# EAGLE design lamloei_node32s3mini_cp2102_main_2layers (EAGLE 7.7.0)
CNAME: LamLoei Node32S3Mini; CREVISION: R1; DESIGNER: lamloei co.,ltd.
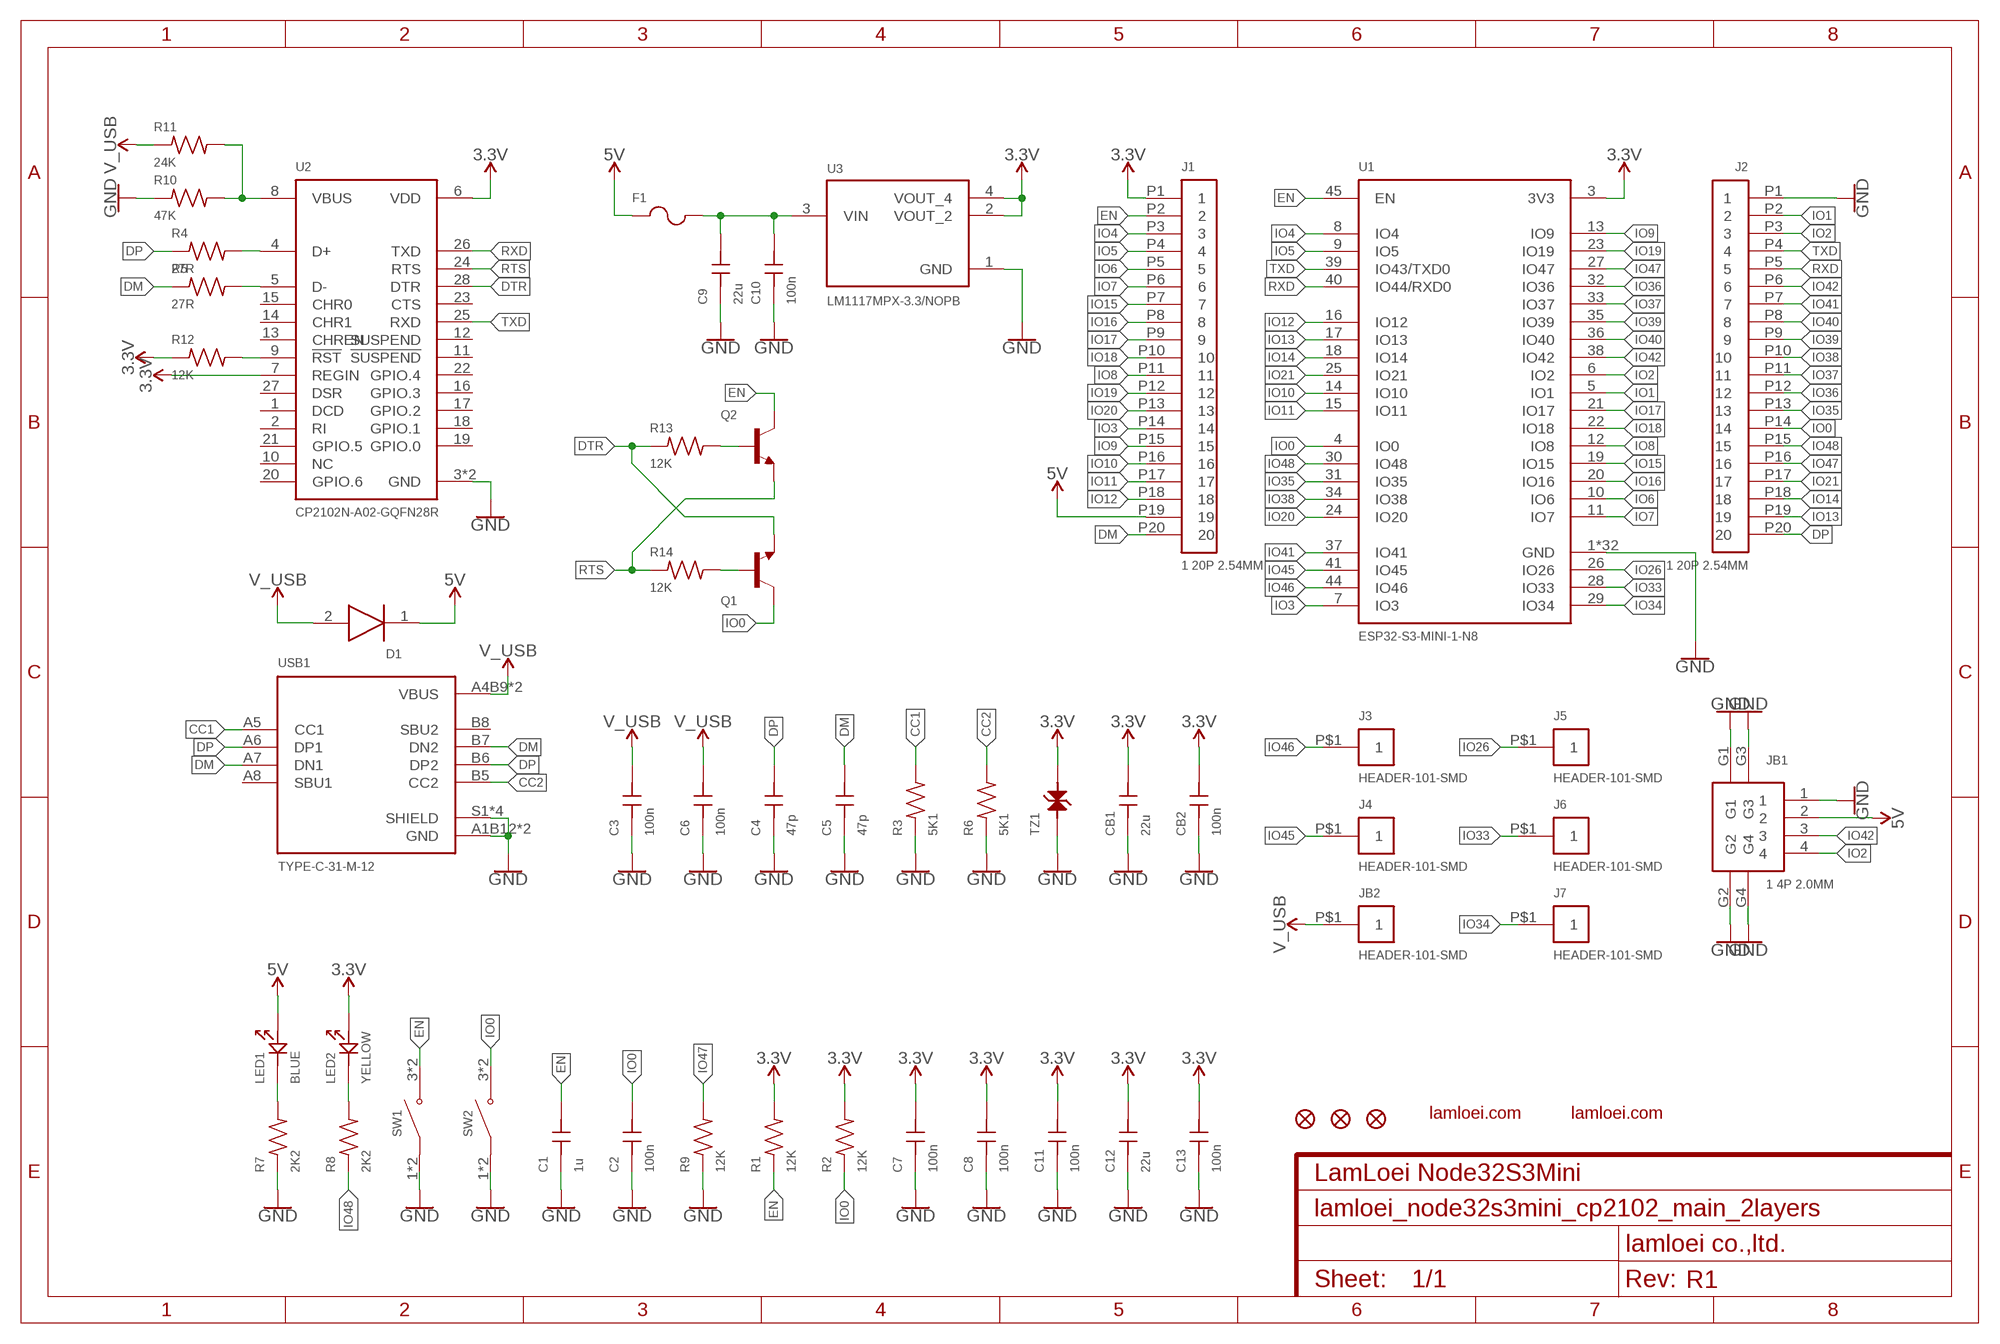
[diagram p0: schematic, sheet 1]

## Parts
C1  1u  GRM155R70J105KA12D  [GRM155R70J105KA12D]
C2  100n  GCM155R71H104KE02D  [GCM155R71H104KE02D]
C3  100n  GCM155R71H104KE02D  [GCM155R71H104KE02D]
C4  47p  GCM1555C1H470JA16D  [GCM1555C1H470JA16D]
C5  47p  GCM1555C1H470JA16D  [GCM1555C1H470JA16D]
C6  100n  GCM155R71H104KE02D  [GCM155R71H104KE02D]
C7  100n  GCM155R71H104KE02D  [GCM155R71H104KE02D]
C8  100n  GCM155R71H104KE02D  [GCM155R71H104KE02D]
C9  22u  GCM21BR71H105KA03L  [GCM21BR71H105KA03L]
C10  100n  GCM155R71H104KE02D  [GCM155R71H104KE02D]
C11  100n  GCM155R71H104KE02D  [GCM155R71H104KE02D]
C12  22u  GCM21BR71H105KA03L  [GCM21BR71H105KA03L]
C13  100n  GCM155R71H104KE02D  [GCM155R71H104KE02D]
CB1  22u  GCM21BR71H105KA03L  [GCM21BR71H105KA03L]
CB2  100n  GCM155R71H104KE02D  [GCM155R71H104KE02D]
D1  PMEG4050EP,115  [PMEG4050EP,115]
F1  MF-NSMF050-2  [MF-NSMF050-2]
J1  1 20P 2.54MM  HEADER-120  [HEADER-120]
J2  1 20P 2.54MM  HEADER-120  [HEADER-120]
J3  HEADER-101-SMD  [HEADER-101-SMD]
J4  HEADER-101-SMD  [HEADER-101-SMD]
J5  HEADER-101-SMD  [HEADER-101-SMD]
J6  HEADER-101-SMD  [HEADER-101-SMD]
J7  HEADER-101-SMD  [HEADER-101-SMD]
JB1  1 4P 2.0MM  A2012WR-S-4P  [A2012WR-S-4P]
JB2  HEADER-101-SMD  [HEADER-101-SMD]
LED1  BLUE  19-217BHC-ZL1M2RY3T  [19-217BHC-ZL1M2RY3T]
LED2  YELLOW  19-213/Y2C-CQ2R2L/3T(CY)  [19-213/Y2C-CQ2R2L/3T(CY)]
Q1  BC847B,215  [BC847B,215]
Q2  BC847B,215  [BC847B,215]
R1  12K  RC0402FR-0712KL  [R0402]
R2  12K  RC0402FR-0712KL  [R0402]
R3  5K1  RC0402FR-075K1L  [R0402]
R4  27R  RC0402FR-0727RL  [R0402]
R5  27R  RC0402FR-0727RL  [R0402]
R6  5K1  RC0402FR-075K1L  [R0402]
R7  2K2  RC0402FR-072K2L  [R0402]
R8  2K2  RC0402FR-072K2L  [R0402]
R9  12K  RC0402FR-0712KL  [R0402]
R10  47K  RC0402FR-0747KL  [R0402]
R11  24K  RC0402FR-0724KL  [R0402]
R12  12K  RC0402FR-0712KL  [R0402]
R13  12K  RC0402FR-0712KL  [R0402]
R14  12K  RC0402FR-0712KL  [R0402]
SW1  K2-1808SN-A4SW-01  [K2-1808SN-A4SW-01]
SW2  K2-1808SN-A4SW-01  [K2-1808SN-A4SW-01]
TZ1  LXES15AAA1-153  [LXES15AAA1-153]
U1  ESP32-S3-MINI-1-N8  [ESP32-S3-MINI-1-N8]
U2  CP2102N-A02-GQFN28R  [CP2102N-A02-GQFN28R]
U3  LM1117MPX-3.3/NOPB  [LM1117MPX-3.3/NOPB]
USB1  TYPE-C-31-M-12  [TYPE-C-31-M-12]
ZFD1  FIDUCIAL1X2  [FIDUCIAL-1X2]
ZFD2  FIDUCIAL1X2  [FIDUCIAL-1X2]
ZFD3  FIDUCIAL1X2  [FIDUCIAL-1X2]
ZL1  LAMLEOI_LOGO_3  [LAMLEOI_LOGO_3]
ZL2  LAMLEOI_LOGO_3  [LAMLEOI_LOGO_3]

## Nets
3.3V: C7.2 C8.2 C11.2 C12.2 C13.2 CB1.2 CB2.2 J1.P1 LED2.2 R1.2 R2.2 R12.1 TZ1.2 U1.3(3V3) U2.6(VDD) U2.7(REGIN) U3.2(VOUT_2) U3.4(VOUT_4)
5V: D1.1(K) F1.1 J1.P19 JB1.2 LED1.2
CC1: R3.2 USB1.A5(CC1)
CC2: R6.2 USB1.B5(CC2)
DM: C5.2 J1.P20 R5.1 USB1.A7(DN1) USB1.B7(DN2)
DP: C4.2 J2.P20 R4.1 USB1.A6(DP1) USB1.B6(DP2)
DTR: Q1.E R13.1 U2.28(DTR)
EN: C1.2 J1.P2 Q2.C R1.1 SW1.3(NO) SW1.4(NO) U1.45(EN)
GND: C1.1 C2.1 C3.1 C4.1 C5.1 C6.1 C7.1 C8.1 C9.1 C10.1 C11.1 C12.1 C13.1 CB1.1 CB2.1 J2.P1 JB1.1 JB1.G1 JB1.G2 JB1.G3 JB1.G4 R3.1 R6.1 R7.1 R9.1 R10.1 SW1.1(COM) SW1.2(COM) SW2.1(COM) SW2.2(COM) TZ1.1 U1.1(GND) U1.2(GND) U1.42(GND) U1.43(GND) U1.46(GND) U1.47(GND) U1.48(GND) U1.49(GND) U1.50(GND) U1.51(GND) U1.52(GND) U1.53(GND) U1.54(GND) U1.55(GND) U1.56(GND) U1.57(GND) U1.58(GND) U1.59(GND) U1.60(GND) U1.61(GND) U1.61_1(GND) U1.61_2(GND) U1.61_3(GND) U1.61_4(GND) U1.61_5(GND) U1.61_6(GND) U1.61_7(GND) U1.61_8(GND) U1.62(GND) U1.63(GND) U1.64(GND) U1.65(GND) U2.3(GND) U2.29(GND) U3.1(GND) USB1.A1B12(GND) USB1.B1A12(GND) USB1.S1(SHIELD) USB1.S2(SHIELD) USB1.S3(SHIELD) USB1.S4(SHIELD)
IO0: C2.2 J2.P14 Q1.C R2.1 SW2.3(NO) SW2.4(NO) U1.4(IO0)
IO1: J2.P2 U1.5(IO1)
IO2: J2.P3 JB1.4 U1.6(IO2)
IO3: J1.P14 U1.7(IO3)
IO4: J1.P3 U1.8(IO4)
IO5: J1.P4 U1.9(IO5)
IO6: J1.P5 U1.10(IO6)
IO7: J1.P6 U1.11(IO7)
IO8: J1.P11 U1.12(IO8)
IO9: J1.P15 U1.13(IO9)
IO10: J1.P16 U1.14(IO10)
IO11: J1.P17 U1.15(IO11)
IO12: J1.P18 U1.16(IO12)
IO13: J2.P19 U1.17(IO13)
IO14: J2.P18 U1.18(IO14)
IO15: J1.P7 U1.19(IO15)
IO16: J1.P8 U1.20(IO16)
IO17: J1.P9 U1.21(IO17)
IO18: J1.P10 U1.22(IO18)
IO19: J1.P12 U1.23(IO19)
IO20: J1.P13 U1.24(IO20)
IO21: J2.P17 U1.25(IO21)
IO26: J5.P$1 U1.26(IO26)
IO33: J6.P$1 U1.28(IO33)
IO34: J7.P$1 U1.29(IO34)
IO35: J2.P13 U1.31(IO35)
IO36: J2.P12 U1.32(IO36)
IO37: J2.P11 U1.33(IO37)
IO38: J2.P10 U1.34(IO38)
IO39: J2.P9 U1.35(IO39)
IO40: J2.P8 U1.36(IO40)
IO41: J2.P7 U1.37(IO41)
IO42: J2.P6 JB1.3 U1.38(IO42)
IO45: J4.P$1 U1.41(IO45)
IO46: J3.P$1 U1.44(IO46)
IO47: J2.P16 R9.2 U1.27(IO47)
IO48: J2.P15 R8.1 U1.30(IO48)
N$1: R5.2 U2.5(D-)
N$2: R4.2 U2.4(D+)
N$3: C9.2 C10.2 F1.2 U3.3(VIN)
N$4: LED1.1 R7.2
N$5: LED2.1 R8.2
N$6: Q2.B R13.2
N$7: Q1.B R14.2
N$8: R12.2 U2.9(!RST)
N$10: R10.2 R11.2 U2.8(VBUS)
RTS: Q2.E R14.1 U2.24(RTS)
RXD: J2.P5 U1.40(IO44/RXD0) U2.26(TXD)
TXD: J2.P4 U1.39(IO43/TXD0) U2.25(RXD)
V_USB: C3.2 C6.2 D1.2(A) JB2.P$1 R11.1 USB1.A4B9(VBUS) USB1.B4A9(VBUS)
Unconnected: U2.1(DCD) U2.2(RI) U2.10(NC) U2.11(!SUSPEND) U2.12(SUSPEND) U2.13(CHREN) U2.14(CHR1) U2.15(CHR0) U2.16(GPIO.3) U2.17(GPIO.2) U2.18(GPIO.1) U2.19(GPIO.0) U2.20(GPIO.6) U2.22(GPIO.4) U2.23(CTS) U2.27(DSR) USB1.A8(SBU1) USB1.B8(SBU2)

## Power pins joined to a net without a drawn wire
GPIO.5: U2.21(GPIO.5)

## Library data of the parts
C1 = lamloei_e77_GRM155R70J105KA12D:GRM155R70J105KA12D; MANUFACTURER_PART_NUMBER: GRM155R70J105KA12D; VENDOR: Murata
C2 C3 C6-C8 C10 C11 C13 CB2 = lamloei_e77_GCM155R71H104KE02D:GCM155R71H104KE02D; MANUFACTURER_PART_NUMBER: GCM155R71H104KE02D; VENDOR: Murata
C4 C5 = lamloei_e77_GCM1555C1H470JA16D:GCM1555C1H470JA16D; MANUFACTURER_PART_NUMBER: GCM1555C1H470JA16D; VENDOR: Murata
C9 C12 CB1 = lamloei_e77_GCM21BR71H105KA03L:GCM21BR71H105KA03L; MANUFACTURER_PART_NUMBER: GCM21BR71H105KA03L; VENDOR: Murata
D1 = lamloei_e77_PMEG4050EP_115:PMEG4050EP,115: Nexperia PMEG4050EP,115 SMT Schottky Diode, 40V 5A, 2-Pin SOD-128 Source: Datasheet <http://uk.rs-online.com/web/p/products/7805405P>; DESCRIPTION: Nexperia PMEG4050EP,115 SMT Schottky Diode, 40V 5A, 2-Pin SOD-128; HEIGHT: 1.1mm; MANUFACTURER_NAME: Nexperia; MANUFACTURER_PART_NUMBER: PMEG4050EP,115; RS_PART_NUMBER: 7805405P; RS_PRICE-STOCK: http://uk.rs-online.com/web/p/products/7805405P
F1 = lamloei_e77_mf-nsmf050-2-noretrict:MF-NSMF050-2; DATASHEET: https://datasheet.lcsc.com/lcsc/1809212037_BOURNS-MF-NSMF050-2_C75464.pdf; DESCRIPTIONS: 13.2V 1A 1206 PTC Resettable Fuses; LCSC_PART: C75464; MANUFACTURER: BOURNS; MANUFACTURER_PART_NUMBER: MF-NSMF050-2; OPERATION_TEMPERATURE: -40°C ~ +85°C; OPERATION_TEMPERATURE_HIGH: +85°C; OPERATION_TEMPERATURE_LOW: -40°C; PACKAGE: 1206; PCBA_COST: Extended
J1 = lamloei_e77_HEADER-120A:HEADER-120
J2 = lamloei_e77_HEADER-120B:HEADER-120
J3-J7 JB2 = lamloei_e77_HEADER-101-SMD:HEADER-101-SMD
JB1 = lamloei_e77_a2012wr-s-4p:A2012WR-S-4P
LED1 = lamloei_e77_19-217BHC-ZL1M2RY3T:19-217BHC-ZL1M2RY3T; MANUFACTURER_PART_NUMBER: 19-217BHC-ZL1M2RY3T; VENDOR: Everlight Elec
LED2 = lamloei_e77_19-213Y2C-CQ2R2L3T(CY):19-213/Y2C-CQ2R2L/3T(CY); MANUFACTURER_PART_NUMBER: 19-213/Y2C-CQ2R2L/3T(CY); VENDOR: Everlight Elec
Q1 Q2 = lamloei_e77_bc847b_215:BC847B,215; AVAILABILITY: In Stock; DESCRIPTION: Bipolar (BJT) Transistor NPN 45V 100mA 100MHz 300mW Surface Mount SOT-23-3 (TO-236); MF: ON Semiconductor; MP: BC847BLT3G; PACKAGE: SOT-23-3 ON Semiconductor; PRICE: None
R1 R2 R9 R12-R14 = lamloei_e77_rc0402fr-0712kl:RC0402FR-0712KL; DATASHEET: https://datasheet.lcsc.com/lcsc/1811081726_YAGEO-RC0402FR-0712KL_C114760.pdf; DESCRIPTIONS: 12kΩ ±1% 0.0625W ±100ppm/°C; DIELECTRIC: X7R; LCSC_PART: C114760; MANUFACTURER: YAGEO; MANUFACTURER_PART_NUMBER: RC0402FR-0712KL; OPERATION_POWER: 1/16W; OPERATION_TEMPERATURE: -55°C ~ +155°C; OPERATION_TEMPERATURE_HIGH: +155°C; OPERATION_TEMPERATURE_LOW: -55°C; PACKAGE: 0402; PCBA_COST: EXTENDED; RATED_VOLTAGE: 100VDC; RESISTANCE: 12kΩ; TOLERANCE: ±1%
R3 R6 = lamloei_e77_rc0402fr-075k1l:RC0402FR-075K1L; DATASHEET: https://datasheet.lcsc.com/lcsc/1809201112_YAGEO-RC0402FR-075K1L_C105872.pdf; DESCRIPTIONS: 5.1kΩ ±1% 0.0625W ±100ppm/°C; DIELECTRIC: X7R; LCSC_PART: C105872; MANUFACTURER: YAGEO; MANUFACTURER_PART_NUMBER: RC0402FR-075K1L; OPERATION_POWER: 1/16W; OPERATION_TEMPERATURE: -55°C ~ +155°C; OPERATION_TEMPERATURE_HIGH: +155°C; OPERATION_TEMPERATURE_LOW: -55°C; PACKAGE: 0402; PCBA_COST: EXTENDED; RATED_VOLTAGE: 100VDC; RESISTANCE: 5.1kΩ; TOLERANCE: ±1%
R4 R5 = lamloei_e77_rc0402fr-0727rl:RC0402FR-0727RL; DATASHEET: https://datasheet.lcsc.com/lcsc/1810241334_YAGEO-RC0402FR-0727RL_C138021.pdf; DESCRIPTIONS: 27Ω ±1% 0.0625W ±100ppm/°C; DIELECTRIC: X7R; LCSC_PART: C138021; MANUFACTURER: YAGEO; MANUFACTURER_PART_NUMBER: RC0402FR-0727RL; OPERATION_POWER: 1/16W; OPERATION_TEMPERATURE: -55°C ~ +155°C; OPERATION_TEMPERATURE_HIGH: +155°C; OPERATION_TEMPERATURE_LOW: -55°C; PACKAGE: 0402; PCBA_COST: EXTENDED; RATED_VOLTAGE: 100VDC; RESISTANCE: 27Ω; TOLERANCE: ±1%
R7 R8 = lamloei_e77_rc0402fr-072k2l:RC0402FR-072K2L; DATASHEET: https://datasheet.lcsc.com/lcsc/1809201112_YAGEO-RC0402FR-072K2L_C114762.pdf; DESCRIPTIONS: 2.2kΩ ±1% 0.0625W ±100ppm/°C; DIELECTRIC: X7R; LCSC_PART: C114762; MANUFACTURER: YAGEO; MANUFACTURER_PART_NUMBER: RC0402FR-072K2L; OPERATION_POWER: 1/16W; OPERATION_TEMPERATURE: -55°C ~ +155°C; OPERATION_TEMPERATURE_HIGH: +155°C; OPERATION_TEMPERATURE_LOW: -55°C; PACKAGE: 0402; PCBA_COST: EXTENDED; RATED_VOLTAGE: 100VDC; RESISTANCE: 2.2kΩ; TOLERANCE: ±1%
R10 = lamloei_e77_rc0402fr-0747kl:RC0402FR-0747KL; DATASHEET: https://datasheet.lcsc.com/lcsc/1811011510_YAGEO-RC0402FR-0747KL_C93943.pdf; DESCRIPTIONS: 47kΩ ±1% 0.0625W ±100ppm/°C; DIELECTRIC: X7R; LCSC_PART: C93943; MANUFACTURER: YAGEO; MANUFACTURER_PART_NUMBER: RC0402FR-0747KL; OPERATION_POWER: 1/16W; OPERATION_TEMPERATURE: -55°C ~ +155°C; OPERATION_TEMPERATURE_HIGH: +155°C; OPERATION_TEMPERATURE_LOW: -55°C; PACKAGE: 0402; PCBA_COST: EXTENDED; RATED_VOLTAGE: 100VDC; RESISTANCE: 47kΩ; TOLERANCE: ±1%
R11 = lamloei_e77_rc0402fr-0724kl:RC0402FR-0724KL; DATASHEET: https://datasheet.lcsc.com/lcsc/1810241334_YAGEO-RC0402FR-0724KL_C138026.pdf; DESCRIPTIONS: 24kΩ ±1% 0.0625W ±100ppm/°C; DIELECTRIC: X7R; LCSC_PART: C138026; MANUFACTURER: YAGEO; MANUFACTURER_PART_NUMBER: RC0402FR-0724KL; OPERATION_POWER: 1/16W; OPERATION_TEMPERATURE: -55°C ~ +155°C; OPERATION_TEMPERATURE_HIGH: +155°C; OPERATION_TEMPERATURE_LOW: -55°C; PACKAGE: 0402; PCBA_COST: EXTENDED; RATED_VOLTAGE: 100VDC; RESISTANCE: 24kΩ; TOLERANCE: ±1%
SW1 SW2 = lamloei_e77_K2-1808SN-A4SW-01:K2-1808SN-A4SW-01: Check prices <https://pricing.snapeda.com/parts/4-1437565-2/TE%20Connectivity/view-part?ref=eda>; AVAILABILITY: In Stock; COMMENT: 4-1437565-2; CONFIGURATION_POLE-THROW: Single Pole - Single Throw; CONTACT_CURRENT_RATING: 50 mA; DESCRIPTION: Tactile Switch SPST-NO Top Actuated Surface Mount; EU_ROHS_COMPLIANCE: Compliant; MF: TE Connectivity; MP: 4-1437565-2; PACKAGE: None; PRICE: None
TZ1 = lamloei_e77_lxes15aaa1-153:LXES15AAA1-153; DATASHEET: https://datasheet.lcsc.com/lcsc/1811081617_Murata-Electronics-LXES15AAA1-153_C86141.pdf; DESCRIPTIONS: Bidirectional 4V 0402 Diodes - ESD; LCSC_PART: C86141; MANUFACTURER: Murata; MANUFACTURER_PART_NUMBER: LXES15AAA1-153; OPERATION_TEMPERATURE: -40°C ~ +85°C; OPERATION_TEMPERATURE_HIGH: +85°C; OPERATION_TEMPERATURE_LOW: -40°C; PACKAGE: 0402; PCBA_COST: EXTENDED; RATED_VOLTAGE: 4V
U1 = lamloei_e77_ESP32-S3-MINI-ANT:ESP32-S3-MINI-1-N8
U2 = lamloei_e77_cp2102n-a02-gqfn24r:CP2102N-A02-GQFN28R
U3 = lamloei_e77_LM1117MPX-3.3_NOPB:LM1117MPX-3.3/NOPB: 800-mA 15-V linear voltage regulator 4-SOT-223 0 to 125 Check prices <https://pricing.snapeda.com/parts/LM1117MPX-3.3/NOPB/Texas%20Instruments/view-part?ref=eda>; AVAILABILITY: In Stock; DESCRIPTION: 800-mA 15-V linear voltage regulator 4-SOT-223 0 to 125; MF: Texas Instruments; MP: LM1117MPX-3.3/NOPB; PACKAGE: SOT-223-4 Texas Instruments; PRICE: None; PURCHASE-URL: https://pricing.snapeda.com/search/part/LM1117MPX-3.3/NOPB/?ref=eda
USB1 = _lamloei_e77_TYPE-C-31-M-12:TYPE-C-31-M-12; AVAILABILITY: Unavailable; DESCRIPTION: USB Connectors 24 Receptacle 1 8.94*7.3mm RoHS; DIFFX: 1.75; DIFFY: -3.53; MF: HRO Electronics Co., Ltd.; MP: TYPE-C-31-M-12; PACKAGE: Package; PRICE: None
ZFD1-ZFD3 = SparkFun-Aesthetics:FIDUCIAL: Fiducial Alignment Points Point-of-reference for pick-and-place machines and other optical instruments.
ZL1 ZL2 = lamloei_logo_3:LAMLEOI_LOGO_3: lamloei

## Board
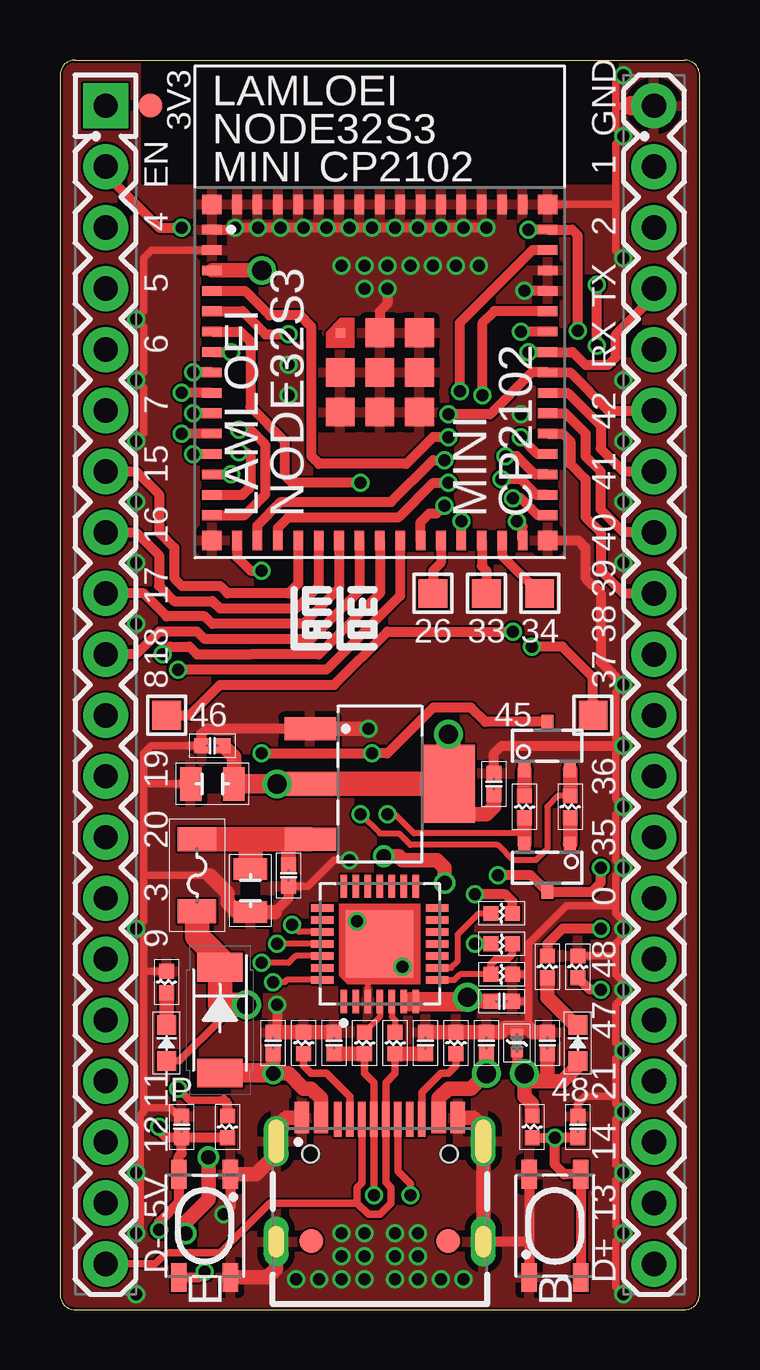
[diagram p1: board, top side]
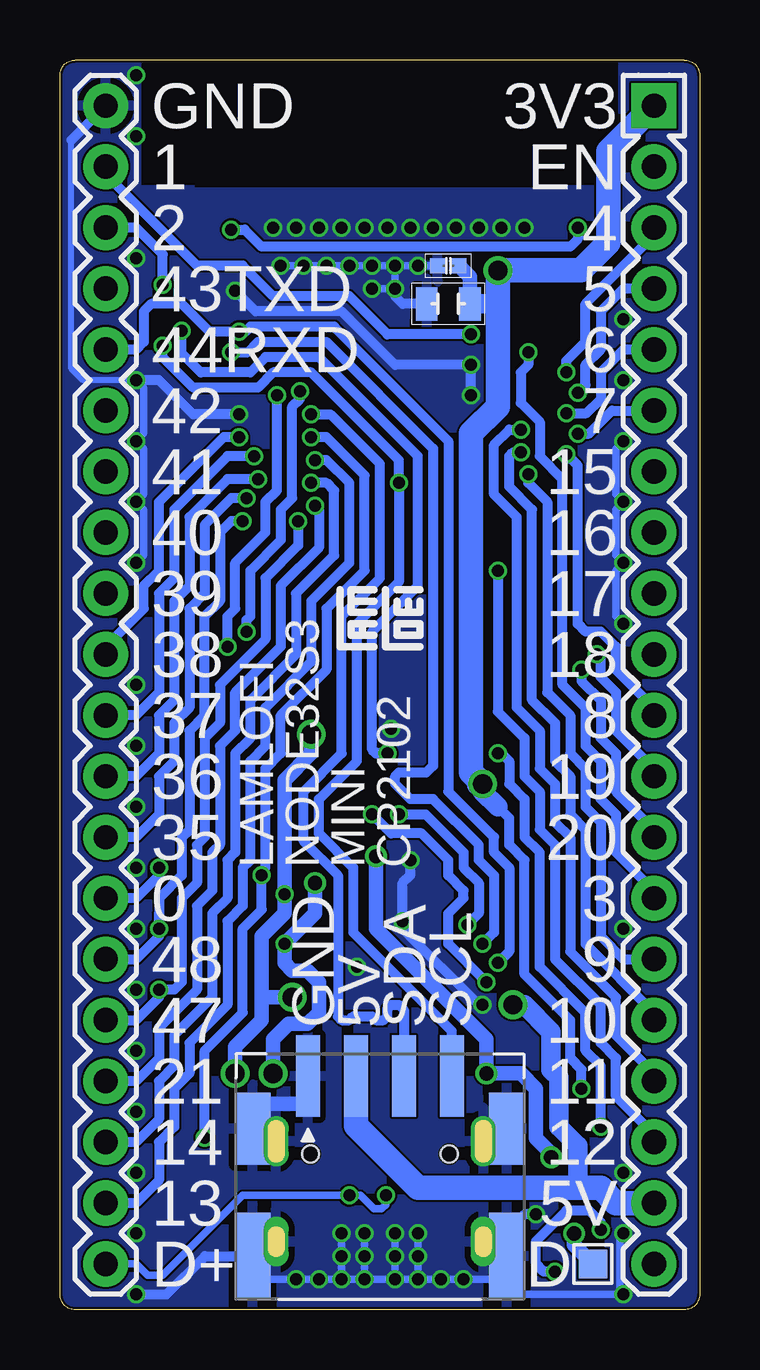
[diagram p2: board, bottom side, seen from below]

Size 26.67 x 52.07 mm. Coordinates in mm from the lower left corner, seen from the top.
Outline: 26.04,0 arc90 26.67,0.64 26.67,51.44 arc90 26.04,52.07 0.64,52.07 arc90 0,51.44 0,0.64 arc90 0.64,0 26.04,0
Copper layers (1*16): Top 0.035mm / dielectric 0.2mm / Bottom 0.035mm
Design rules "jlcpcb-2-layer": minimum track width 3.5mil, minimum drill 0.2mm, track to track 3.5mil, track to pad 5mil, pad to pad 5mil, via to via 5mil, smd to smd 0mil, copper to edge 0.1mm, drill to drill 5mil, minimum pad ring 4mil, minimum via ring 4mil, stop-mask expansion 3mil, vias tented up to drill 100mil, thermal gap 10mil

### Footprints (pad centres in the part's own frame; a part is rotated, then mirrored left to right if it is on the bottom)
GRM155R70J105KA12D = smd 0.62 x 0.62: 1 -0.45,0; 2 0.45,0
GCM155R71H104KE02D = smd 0.62 x 0.62: 1 -0.45,0; 2 0.45,0
GCM1555C1H470JA16D = smd 0.62 x 0.62: 1 -0.45,0; 2 0.45,0
GCM21BR71H105KA03L = smd 0.9 x 1.4: 1 -0.9,0; 2 0.9,0
PMEG4050EP,115 = smd 1.2 x 1.9: 1 -2.2,0; 2 2.2,0
MF-NSMF050-2 = smd 1 x 1.6: 1 -1.5,0; 2 1.5,0
HEADER-120 = drill 1.016 pad 1.88 square: P1 24.13,0 | drill 1.016 pad 1.88: P2 21.59,0; P3 19.05,0; P4 16.51,0; P5 13.97,0; P6 11.43,0; P7 8.89,0; P8 6.35,0; P9 3.81,0; P10 1.27,0; P11 -1.27,0; P12 -3.81,0; P13 -6.35,0; P14 -8.89,0; P15 -11.43,0; P16 -13.97,0; P17 -16.51,0; P18 -19.05,0; P19 -21.59,0; P20 -24.13,0
HEADER-120' = drill 1.016 pad 1.88: P1 24.13,0; P2 21.59,0; P3 19.05,0; P4 16.51,0; P5 13.97,0; P6 11.43,0; P7 8.89,0; P8 6.35,0; P9 3.81,0; P10 1.27,0; P11 -1.27,0; P12 -3.81,0; P13 -6.35,0; P14 -8.89,0; P15 -11.43,0; P16 -13.97,0; P17 -16.51,0; P18 -19.05,0; P19 -21.59,0; P20 -24.13,0
HEADER-101-SMD = smd 1.2 x 1.2: P$1 0,0
A2012WR-S-4P = smd 1 x 3.4: 1 -3,3.7; 2 -1,3.7; 3 1,3.7; 4 3,3.7 | smd 1.5 x 3.6: G1 -5.3,-3.8; G2 5.3,-3.8 | smd 1.5 x 3: G3 -5.3,1.5; G4 5.3,1.5
19-217BHC-ZL1M2RY3T = smd 0.8 x 0.8: 1 -0.75,0; 2 0.75,0
19-213/Y2C-CQ2R2L/3T(CY) = smd 0.8 x 0.8: 1 -0.75,0; 2 0.75,0
BC847B,215 = smd 0.6 x 0.5: B 1,-0.95; C -1,0; E 1,0.95
R0402 = smd 0.62 x 0.62: 1 -0.45,0; 2 0.45,0
K2-1808SN-A4SW-01 = smd 1.2 x 0.65: 1 -2.15,1.075; 2 2.15,1.075; 3 -2.15,-1.075; 4 2.15,-1.075
LXES15AAA1-153 = smd 0.4 x 0.5: 1 -0.4,0; 2 0.4,0
ESP32-S3-MINI-1-N8 = smd 0.8 x 0.4: 1 -7,5.95; 2 -7,5.1; 3 -7,4.25; 4 -7,3.4; 5 -7,2.55; 6 -7,1.7; 7 -7,0.85; 8 -7,0; 9 -7,-0.85; 10 -7,-1.7; 11 -7,-2.55; 12 -7,-3.4; 13 -7,-4.25; 14 -7,-5.1; 15 -7,-5.95; 31 7,-5.95; 32 7,-5.1; 33 7,-4.25; 34 7,-3.4; 35 7,-2.55; 36 7,-1.7; 37 7,-0.85; 38 7,0; 39 7,0.85; 40 7,1.7; 41 7,2.55; 42 7,3.4; 43 7,4.25; 44 7,5.1; 45 7,5.95 | smd 0.4 x 0.8: 16 -5.95,-7; 17 -5.1,-7; 18 -4.25,-7; 19 -3.4,-7; 20 -2.55,-7; 21 -1.7,-7; 22 -0.85,-7; 23 0,-7; 24 0.85,-7; 25 1.7,-7; 26 2.55,-7; 27 3.4,-7; 28 4.25,-7; 29 5.1,-7; 30 5.95,-7; 46 5.95,7; 47 5.1,7; 48 4.25,7; 49 3.4,7; 50 2.55,7; 51 1.7,7; 52 0.85,7; 53 0,7; 54 -0.85,7; 55 -1.7,7; 56 -2.55,7; 57 -3.4,7; 58 -4.25,7; 59 -5.1,7; 60 -5.95,7 | smd 1.2 x 1.2: 61 0,0; 61_2 0,1.65; 61_3 1.65,1.65; 61_4 1.65,0; 61_5 1.65,-1.65; 61_6 0,-1.65; 61_7 -1.65,-1.65; 61_8 -1.65,0 | smd 0.4 x 0.4: 61_1 -1.65,1.65 | smd 0.8 x 0.8: 62 -7,7; 63 -7,-7; 64 7,-7; 65 7,7
CP2102N-A02-GQFN28R = smd 0.95 x 0.29: 1 -2.4,1.5; 2 -2.4,1; 3 -2.4,0.5; 4 -2.4,0; 5 -2.4,-0.5; 6 -2.4,-1; 7 -2.4,-1.5; 15 2.4,-1.5; 16 2.4,-1; 17 2.4,-0.5; 18 2.4,0; 19 2.4,0.5; 20 2.4,1; 21 2.4,1.5 | smd 0.29 x 0.95: 8 -1.5,-2.4; 9 -1,-2.4; 10 -0.5,-2.4; 11 0,-2.4; 12 0.5,-2.4; 13 1,-2.4; 14 1.5,-2.4; 22 1.5,2.4; 23 1,2.4; 24 0.5,2.4; 25 0,2.4; 26 -0.5,2.4; 27 -1,2.4; 28 -1.5,2.4 | smd 2.8 x 2.8: 29 0,0
LM1117MPX-3.3/NOPB = smd 2.15 x 0.95: 1 2.9,-2.3; 2 2.9,0; 3 2.9,2.3 | smd 2.15 x 3.25: 4 -2.9,0
TYPE-C-31-M-12 = smd 0.6 x 1.3: A1B12 3.25,-3.56; A4B9 2.45,-3.56; B1A12 -3.25,-3.56; B4A9 -2.45,-3.56 | smd 0.3 x 1.45: A5 1.25,-3.485; A6 0.25,-3.485; A7 -0.25,-3.485; A8 -1.25,-3.485; B5 -1.75,-3.485; B6 -0.75,-3.485; B7 0.75,-3.485; B8 1.75,-3.485 | drill 0.65 pad 1.05 long: S1 4.32,-2.57; S2 -4.32,-2.57; S3 4.32,1.61; S4 -4.32,1.61 | hole 0.7: 2.89,-2.04; -2.89,-2.04
FIDUCIAL-1X2 = smd 1 x 1: 1 0,0

### Placement (x,y rotation side)
C1  5.08,7.62 270 top
C2  21.59,7.62 270 top
C3  8.89,11.11 270 top
C4  11.43,11.11 270 top
C5  15.24,11.11 270 top
C6  17.78,11.11 270 top
C7  20.32,11.11 270 top
C8  18.41,12.86 180 top
C9  7.94,17.46 90 top
C10  9.53,18.1 90 top
C11  18.1,21.91 270 top
C12  6.35,21.91 0 top
C13  6.35,23.5 0 top
CB1  10.48,41.91 0 bottom
CB2  10.48,43.5 0 bottom
D1  6.67,12.06 270 top
F1  5.71,18.1 90 top
J1  1.91,26.04 90 top
J2  1 20P 2.54MM  [HEADER-120']  24.77,26.04 90 top
J3  4.45,24.77 0 top
J4  22.23,24.77 0 top
J5  15.56,29.84 0 top
J6  17.78,29.84 0 top
J7  20,29.84 0 top
JB1  13.34,6.03 0 bottom
JB2  4.45,1.91 0 bottom
LED1  4.45,11.11 270 top
LED2  21.59,11.11 270 top
Q1  20.32,18.41 90 top
Q2  20.32,23.5 270 top
R1  6.99,7.62 90 top
R2  19.68,7.62 90 top
R3  10.16,11.11 270 top
R4  12.7,11.11 90 top
R5  13.97,11.11 90 top
R6  16.51,11.11 270 top
R7  4.45,13.65 270 top
R8  20.32,14.29 270 top
R9  21.59,14.29 270 top
R10  18.41,13.97 180 top
R11  18.41,15.24 0 top
R12  18.41,16.51 180 top
R13  19.37,20.95 90 top
R14  21.27,20.95 270 top
SW1  6.03,3.49 270 top
SW2  20.64,3.49 90 top
TZ1  19.05,11.11 270 top
U1  13.34,39.05 0 top
U2  13.34,15.24 90 top
U3  13.34,21.91 180 top
USB1  13.34,4.45 180 top
ZFD1  3.77,50.16 0 top
ZFD2  10.48,2.86 0 top
ZFD3  16.19,2.86 0 top
ZL1  9.45,27.3 0 top
ZL2  15.32,27.3 0 bottom

### Tracks (layer width: path | path; a pad name or v marks a point on that pad's centre or on a via)
3.3V  (via drill 0.5, 0.8)
  Top 0.254: 12.34,21.91 12.38,21.91 | U2.6 U2.7
  Top 0.305: 6.83,8.73 5.4,8.73 v4.92,9.21
  Top 0.406: TZ1.2 19.05,10.16 v19.37,9.84 | R1.2 6.99,8.57 6.83,8.73 | R12.1 18.86,17.01 18.57,17.3 v17.3,17.3
  Top 0.61: R2.2 19.68,8.57 19.37,8.89 v19.37,9.84 19.37,9.53 20.32,9.53 | LED2.2 21.59,10.16 20.95,9.53 20.32,9.53 | C7.2 20.32,9.53 | C12.2 7.25,23.05 C13.2 | 16.19,21.46 16.19,22.54 | C11.2 18.1,20.95 17.78,20.64 16.23,20.64 U3.4 | C8.2 17.14,12.86 v16.99,13.02 | U1.3 v8.41,43.3
  Top 0.813: C12.2 v9.05,21.91 | v16.99,13.02 16.81,12.84 U2.7 14.61,12.84
  Top 1.016: v16.19,23.97 16.19,22.54 16.19,21.91 U3.4 12.38,21.91 U3.2 v9.05,21.91
  Bottom 0.406: 9.05,21.59 v9.05,21.91 | 8.41,20.95 7.94,20.48 7.94,19.37 7.3,18.73 7.3,13.97 5.4,12.06 5.4,10.48 4.92,10 v4.92,9.21
  Bottom 0.61: v16.19,23.97 16.19,23.18 17.3,22.07 v17.3,17.3 17.3,16.51 18.26,15.56 18.26,13.02 | CB1.2 9.58,43.05 CB2.2 | v19.37,9.84 19.37,10.95 18.26,12.06 18.26,13.02 | 18.26,13.02 v16.99,13.02
  Bottom 0.813: 8.41,20.95 9.05,21.59 | CB1.2 8.41,41.91
  Bottom 1.016: 9.21,21.91 v9.05,21.91 9.53,22.38 9.53,36.51 8.41,37.62 8.41,41.91 v8.41,43.3 4.96,43.3 3.81,44.45 3.81,48.26 J1.P1
5V  (via drill 0.8)
  Top 0.305: LED1.2 4.96,10.36 6.67,12.06 6.67,12.7
  Top 1.016: F1.1 5.71,15.56 6.67,14.61 D1.1 6.67,12.7 v7.78,12.7
  Bottom 0.813: 5.08,5.08 5.08,5.24 5.08,6.83 5.87,7.62 5.87,9.68 6.19,10 6.19,11.59 7.3,12.7 v7.78,12.7
  Bottom 1.016: J1.P19 3.49,4.45 4.13,5.08 5.08,5.08 11.75,5.08 14.34,7.67 JB1.2
CC1
  Top 0.305: USB1.A5 12.09,8.87 11.11,9.84 10.48,9.84 10.16,10.16 R3.2
CC2
  Top 0.305: USB1.B5 15.09,9.05 15.88,9.84 16.19,9.84 16.51,10.16 R6.2
DM
  Top 0.305: R5.1 13.97,9.84 13.59,9.46 USB1.A7 13.59,5.31 13.81,5.08 13.81,4.45 13.34,3.97 12.86,3.97 12.38,4.45 | J1.P20 3.97,1.91 4.45,2.38 6.67,2.38 8.73,4.45 12.38,4.45 | USB1.B7 12.59,5.28 12.38,5.08 12.38,4.45
  Top 0.61: R5.1 C5.2
DP  (via drill 0.5)
  Top 0.305: R4.1 12.7,9.84 13.09,9.46 USB1.A6 v13.09,4.76 | USB1.B6 14.09,5.76 14.61,5.24 v14.61,4.76
  Top 0.61: C4.2 R4.1
  Bottom 0.305: J2.P20 23.5,1.91 23.02,1.43 22.38,1.43 19.05,4.76 v14.61,4.76 14.13,4.76 13.57,4.21 13.26,4.21 13.09,4.38 v13.09,4.76
DTR  (via drill 0.5)
  Top 0.254: Q1.E 19.37,19.68 | 19.37,20 19.37,19.84 14.76,19.84 13.97,20.64 v13.65,20.64 | U2.28 9.45,13.74 9.37,13.65 v8.89,13.65
  Top 0.61: R13.1 | Q1.E 19.37,19.84 19.37,20 R13.1
  Bottom 0.406: v8.89,13.65 10.48,15.24 10.48,16.51 9.84,17.14 9.84,17.46 10.48,18.1 10.48,18.73 11.59,19.84 12.86,19.84 v13.65,20.64
EN  (via drill 0.5)
  Top 0.406: Q2.C 17.73,24.5 17.14,25.08 15.56,25.08 13.65,23.18 v13.02,23.18 v8.41,23.18 | R1.1 C1.2 | C1.2 5.08,6.51 4.96,6.39 SW1.3 4.96,4.48 4.13,3.65 v4.13,3.33 | C1.2 4.42,7.17 4.13,7.46 v4.13,7.62 | SW1.4 5.79,1.34 v6.03,1.59 | v19.53,45 U1.45 21.36,45 21.59,44.77 v21.59,40.8 | J1.P2 1.91,47.31 4.13,45.09 v5.08,45.09
  Bottom 0.406: v8.41,23.18 8.26,23.18 7.94,22.86 7.94,21.91 7.3,21.27 7.3,19.68 6.67,19.05 6.67,14.29 4.76,12.38 4.76,10.79 4.13,10.16 v4.13,7.62 | v4.13,3.33 4.13,3.65 4.6,4.13 5.56,4.13 6.67,3.02 6.83,2.86 6.83,1.91 6.51,1.59 v6.03,1.59 | v13.02,23.18 13.49,23.18 13.65,23.34 13.65,28.26 11.75,30.16 11.75,35.56 15.88,39.69 18.1,39.69 18.73,39.05 20.8,39.05 21.59,39.85 v21.59,40.8 | v19.53,45 18.97,45 18.26,44.29 5.4,44.29 5.08,44.61 v5.08,45.09
GND  (via drill 0.5)
  Top 0.254: U2.3 12.84,15.24 U2.29
  Top 0.305: v3.17,36.2 3.49,36.51 3.49,38.42 v3.17,38.73 3.49,39.05 3.49,40.96 v3.17,41.27 3.49,41.59 3.49,43.81 3.83,44.15 U1.2 | 23.18,50.16 23.18,49.21 v23.5,48.9 23.18,48.58 23.18,46.05 | 23.18,50.16 23.18,51.12 v23.5,51.44 | 23.81,50.16 23.18,50.16 | v23.5,26.04 23.18,25.72 23.18,23.81 v23.5,23.5 23.18,23.18 23.18,21.27 v23.5,20.95 23.18,20.64 23.18,18.73 v23.5,18.41 | v23.5,18.41 23.18,18.1 | v23.5,10.79 23.18,10.48 23.18,8.89 | 23.18,8.89 23.18,8.57 v23.5,8.26 23.18,7.94 23.18,6.03 v23.5,5.71 23.18,5.4 23.18,3.49 v23.5,3.17 23.18,2.86 23.18,0.95 v23.5,0.64 | 23.18,11.11 v23.5,10.79 | 23.18,11.11 23.18,12.7 23.5,13.02 v23.5,13.34 23.5,13.65 23.18,13.97 23.18,14.61 | 23.18,11.11 v23.5,10.79 | 23.18,18.1 v23.5,18.41 | 23.18,14.61 23.18,15.24 23.5,15.56 v23.5,15.88 23.5,16.19 23.18,16.51 23.18,16.67 23.18,16.83 | R9.1 23.18,14.74 23.18,14.61 | 23.18,18.1 23.18,16.83 | C2.1 21.59,8.57 21.91,8.89 23.18,8.89 | C12.1 3.49,21.91 | 23.18,16.83 21.11,16.83 19.53,15.24 19.53,13.97 | 19.53,13.97 19.53,12.86 | 19.53,12.86 19.53,11.75 | C8.1 19.53,12.86 | R10.1 19.53,13.97 | 3.49,18.1 3.49,16.19 v3.17,15.88 3.49,15.56 3.49,14.29 | 3.49,18.1 3.49,21.91 | C10.1 10.35,17.65 11.43,18.73 v12.06,18.73 | 6.24,18.1 3.49,18.1 | R7.1 3.49,14.1 3.49,14.29 | 3.49,14.29 3.49,8.41 | 3.49,8.41 3.49,8.26 3.33,8.1 3.33,5.87 v3.17,5.71 3.33,5.56 3.33,3.33 v3.17,3.17 | C1.1 4.95,8.07 4.6,8.41 3.49,8.41 | C13.1 3.81,23.5 3.49,23.18 3.49,21.91 | 23.18,46.05 U1.65 | v23.5,43.81 23.18,44.13 23.18,46.05
  Top 0.406: 19.05,11.75 TZ1.1 | SW2.2 19.56,2.86 | 19.56,2.86 SW2.1 | USB1.S4 17.68,2.86 19.56,2.86 | C10.1 9.53,17.14 8.94,16.56 | C11.1 18.1,23.18 18.41,23.5 v23.5,23.5 | 9.05,11.56 C3.1 9.05,11.72 v9.05,12.7 | v14.29,14.29 12.84,14.29 12.84,15.24 12.22,15.24 12.22,15.72 12.38,15.72 v12.38,16.19 | SW1.1 7.11,4.25 v6.83,3.97 | U3.1 6.11,24.21 5.9,24 C13.1 | U1.64 21.61,32.05 21.91,31.75 21.91,30.48 22.54,29.84 22.54,26.99 v23.5,26.04 | U1.1 7.22,45 v7.3,45.09 v8.26,45.09 v9.21,45.09 v10.16,45.09 v11.11,45.09 v12.06,45.09 v13.02,45.09 v13.97,45.09 v14.92,45.09 v15.88,45.09 v16.83,45.09 v17.78,45.09 | v13.65,42.55 13.65,41.91 13.34,41.59 U1.61_2 | U1.42 v19.37,42.45
  Top 0.61: C5.1 R6.1 C6.1 18.39,11.56 18.57,11.75 | 18.57,11.75 19.05,11.75 | C7.1 19.71,11.56 19.53,11.75 18.57,11.75 | C3.1 R3.1 C4.1 | USB1.A1B12 9.43,8.01 9.02,7.59 USB1.S1 9.02,6.47 8.18,5.64 SW1.1 | USB1.S4 USB1.S2 17.66,7.59 17.24,8.01 USB1.B1A12 | USB1.S3 9.02,1.71 8.64,1.34 SW1.2 | 8.94,16.56 C9.1 7.41,16.56 6.99,16.99 6.99,17.36 6.24,18.1 | U3.1 v12.86,24.21
  Top 0.813: J2.P1 23.81,50.16
  Bottom 0.254: v23.5,38.73 25.72,38.73 26.19,39.21 26.19,48.74
  Bottom 0.305: v12.7,43.5 v12.7,42.55 v13.65,42.55 | v12.7,43.5 v11.75,43.5 CB2.1 | v12.7,43.5 v13.65,43.5 v14.61,43.5 v15.56,43.5 v16.51,43.5 v17.46,43.5 | 7.93,2.13 7.93,1.27 8.26,1.27 | 8.26,1.27 v9.84,1.27 v10.79,1.27 v11.75,1.27 | v11.75,1.27 v12.7,1.27 | v12.7,1.27 v13.97,1.27 | v13.97,1.27 v14.92,1.27 | v14.92,1.27 v15.88,1.27 v16.83,1.27 18.64,1.27 JB1.G1 | v11.75,1.27 v11.75,2.22 v11.75,3.17 | v12.7,1.27 v12.7,2.22 v12.7,3.17 | v13.97,1.27 v13.97,2.22 v13.97,3.17 | v14.92,1.27 v14.92,2.22 v14.92,3.17 | 8.26,1.27 8.26,0.64 v3.17,0.64 3.33,0.79 3.33,3.02 v3.17,3.17 | v3.17,28.57 3.49,28.89 3.49,30.8 v3.17,31.11 3.49,31.43 3.49,33.34 v3.17,33.66 3.49,33.97 3.49,35.88 v3.17,36.2 | v23.5,31.11 23.18,31.43 23.18,33.34 v23.5,33.66 23.18,33.97 23.18,35.88 v23.5,36.2 23.18,36.51 23.18,38.42 v23.5,38.73
  Bottom 0.406: v23.5,0.64 22.23,0.64 20.63,2.23 JB1.G1 | 7.93,2.83 7.93,3.34 7.3,3.97 v6.83,3.97 | v9.05,12.7 9.21,12.7 12.38,15.88 v12.38,16.19 12.38,17.78 12.06,18.1 v12.06,18.73 | CB1.1 12.38,41.91 12.7,42.23 v12.7,42.55 | v9.53,38.1 v9.53,39.37 12.7,39.37 14.92,41.59 18.51,41.59 v19.37,42.45 | 26.19,48.74 J2.P1 | v23.5,38.73 22.54,38.73 21.11,37.31 v19.21,37.31
  Bottom 0.61: 17.66,7.59 USB1.S2 18.64,7.01 JB1.G3 18.41,7.53 18.41,8.57 16.34,8.57 16.34,8.91 | 7.93,2.83 USB1.S3 9.02,2.23 JB1.G2 7.93,2.13 | JB1.G1 18.64,2.83 USB1.S4 | JB1.G4 9.02,7.53 USB1.S1
  Bottom 1.016: JB1.1 16.34,8.91
  pour Top: 0,0 26.67,0 26.67,52.07 23.5,52.07 23.5,46.67 3.17,46.67 3.17,52.07 0,52.07
  pour Bottom: 0,0 26.67,0 26.67,52.07 23.5,52.07 23.5,46.67 3.17,46.67 3.17,52.07 0,52.07
IO0  (via drill 0.5)
  Top 0.406: R2.1 v20.64,7.17 | v20.64,7.17 20.64,6.03 21.03,5.64 SW2.4 SW2.3 | C2.2 v20.64,7.17 | Q1.C 20.27,17.41 Q1.C | Q1.C 22.18,17.41 22.54,17.78 v22.54,18.41 | Q1.C 19.64,18.1 v18.26,18.1 | U1.4 7.71,42.45 8.73,41.43 10,41.43 10.48,40.96 10.48,35.56 10.79,35.24 14.45,35.24 15.56,36.35 v16.19,36.35
  Bottom 0.406: J2.P14 23.5,17.14 22.54,18.1 v22.54,18.41 | v20.64,7.17 20.64,10.79 19.05,12.38 19.05,15.88 18.26,16.67 v18.26,18.1 18.26,18.26 18.1,18.41 18.1,22.54 17.46,23.18 17.46,24.77 15.56,26.67 15.56,29.21 13.97,30.8 13.97,34.77 15.56,36.35 v16.19,36.35
IO1  (via drill 0.5)
  Top 0.406: U1.5 7.61,41.6 8.57,40.64 v9.53,40.64
  Bottom 0.406: v9.53,40.64 13.02,40.64 14.61,42.23 17.78,42.23 19.05,43.5 20.95,43.5 24.77,47.31 J2.P2
IO2  (via drill 0.5)
  Top 0.406: U1.6 7.51,40.75 7.94,40.32 7.94,37.62 9.37,36.2 9.37,34.77 9.68,34.45 v12.54,34.45 | v22.38,40.16 v22.38,42.7
  Bottom 0.406: JB1.4 10.34,11.61 14.45,15.72 14.45,18.41 15.88,19.84 15.88,21.27 14.29,22.86 14.29,28.57 12.54,30.32 v12.54,34.45 12.54,35.4 16.19,39.05 17.78,39.05 18.41,38.42 21.11,38.42 22.38,39.69 v22.38,40.16 | v22.38,42.7 22.38,43.97 23.5,45.09 J2.P3
IO3  (via drill 0.5)
  Top 0.406: U1.7 v7.14,39.9
  Bottom 0.406: J1.P14 1.91,17.46 3.49,19.05 3.49,20.64 4.13,21.27 4.13,22.86 4.76,23.5 4.76,25.08 5.71,26.04 5.71,34.61 6.67,35.56 6.67,36.99 7.46,37.78 7.46,39.05 7.14,39.37 v7.14,39.9
IO4  (via drill 0.5)
  Top 0.406: U1.8 v5.56,39.05
  Bottom 0.406: J1.P3 1.91,44.77 4.76,41.91 4.76,40.32 5.56,39.53 v5.56,39.05
IO5  (via drill 0.5)
  Top 0.406: U1.9 v5.08,38.2
  Bottom 0.406: J1.P4 3.17,42.55 4.13,41.59 4.13,40.01 4.76,39.37 4.76,38.52 v5.08,38.2
IO6  (via drill 0.5)
  Top 0.406: U1.10 v5.56,37.35
  Bottom 0.406: v5.56,37.35 4.72,37.35 4.13,37.94 4.13,39.05 3.17,40.01 J1.P5
IO7  (via drill 0.5)
  Top 0.406: U1.11 v5.08,36.5
  Bottom 0.406: v5.08,36.5 4.61,36.5 3.65,37.47 J1.P6
IO8  (via drill 0.5)
  Top 0.406: U1.12 v5.56,35.65
  Bottom 0.406: J1.P11 1.91,25.08 3.49,26.67 3.49,27.62 4.13,28.26 4.76,28.26 5.08,28.57 5.08,35.18 v5.56,35.65
IO9  (via drill 0.5)
  Top 0.406: U1.13 v7.14,34.8
  Bottom 0.406: J1.P15 3.17,14.61 4.13,15.56 4.13,20.32 4.76,20.95 4.76,22.54 5.4,23.18 5.4,24.77 6.35,25.72 6.35,33.66 7.14,34.45 v7.14,34.8
IO10  (via drill 0.5)
  Top 0.406: U1.14 7.6,33.95 7.94,34.29 7.94,35.56 7.78,35.72 v7.46,35.72
  Bottom 0.406: J1.P16 1.91,12.38 4.76,15.24 4.76,20 5.4,20.64 5.4,22.23 6.03,22.86 6.03,24.45 6.99,25.4 6.99,33.34 7.94,34.29 7.94,35.56 7.78,35.72 v7.46,35.72
IO11  (via drill 0.5)
  Top 0.406: U1.15 7.7,33.1 8.57,33.97 8.57,36.04 7.94,36.67 v7.46,36.67
  Bottom 0.406: J1.P17 1.91,9.84 3.49,11.43 3.49,13.02 5.4,14.92 5.4,19.68 6.03,20.32 6.03,21.91 6.67,22.54 6.67,24.13 7.62,25.08 7.62,33.02 8.57,33.97 8.57,36.04 7.94,36.67 v7.46,36.67
IO12  (via drill 0.5)
  Top 0.406: U1.16 7.38,31.35 7.94,30.8 v8.41,30.8
  Bottom 0.406: J1.P18 1.91,7.3 3.49,8.89 3.49,10.48 4.13,11.11 4.13,12.7 6.03,14.61 6.03,19.37 6.67,20 6.67,21.59 7.3,22.23 7.3,23.81 8.41,24.92 v8.41,30.8
IO13  (via drill 0.5)
  Top 0.406: U1.17 8.23,32.68 9.21,33.66 13.81,33.66 15.56,35.4 v16.03,35.4
  Bottom 0.406: J2.P19 23.5,4.45 22.54,5.4 22.54,6.99 21.91,7.62 21.91,9.21 21.27,9.84 21.27,11.11 19.68,12.7 19.68,16.19 19.05,16.83 19.05,18.41 18.73,18.73 18.73,22.86 18.1,23.5 18.1,25.08 16.19,26.99 16.19,29.53 14.61,31.11 14.61,34.45 15.56,35.4 v16.03,35.4
IO14  (via drill 0.5)
  Top 0.406: U1.18 9.09,32.58 9.53,33.02 14.13,33.02 15.56,34.45 v16.19,34.45
  Bottom 0.406: J2.P18 23.5,6.99 22.54,7.94 22.54,9.53 21.91,10.16 21.91,11.43 20.32,13.02 20.32,16.51 19.68,17.14 19.68,18.73 19.37,19.05 19.37,23.18 18.73,23.81 18.73,25.4 16.83,27.3 16.83,29.84 15.24,31.43 15.24,34.13 15.56,34.45 v16.19,34.45
IO15
  Top 0.406: J1.P7 3.17,34.92 4.13,33.97 4.13,32.38 4.76,31.75 4.76,30.48 5.08,30.16 6.67,30.16 6.99,29.84 9.53,29.84 9.94,30.25 U1.19
IO16
  Top 0.406: U1.20 10.79,30.15 9.84,29.21 6.67,29.21 6.35,29.53 4.76,29.53 4.13,30.16 4.13,31.43 3.17,32.38 J1.P8
IO17
  Top 0.406: U1.21 11.63,30.05 10.16,28.57 6.35,28.57 6.03,28.89 4.45,28.89 3.49,29.84 J1.P9
IO18
  Top 0.406: U1.22 12.48,29.95 10.48,27.94 6.03,27.94 5.71,28.26 4.13,28.26 3.17,27.3 J1.P10
IO19  (via drill 0.5)
  Top 0.406: U1.23 13.34,29.84 10.79,27.3 7.94,27.3 5.71,27.3 5.4,27.62 4.6,27.62 v4.29,27.3
  Bottom 0.406: J1.P12 1.91,22.54 3.49,24.13 3.49,25.72 4.13,26.35 4.13,27.15 v4.29,27.3
IO20  (via drill 0.5)
  Top 0.406: U1.24 14.19,29.74 11.11,26.67 v4.92,26.67
  Bottom 0.406: v4.92,26.67 4.92,26.19 4.13,25.4 4.13,23.81 3.49,23.18 3.49,21.59 1.91,20 J1.P13
IO21  (via drill 0.5)
  Top 0.406: U1.25 15.04,32.81 15.4,33.18 15.72,33.18 v16.03,33.5
  Bottom 0.406: J2.P17 23.5,9.53 22.54,10.48 22.54,11.75 20.95,13.34 20.95,16.83 20.32,17.46 20.32,19.05 20,19.37 20,23.5 19.37,24.13 19.37,25.72 17.46,27.62 17.46,30.16 15.88,31.75 15.88,33.34 v16.03,33.5
IO26
  Top 0.406: U1.26 15.88,31.12 15.56,30.8 J5.P$1
IO33
  Top 0.406: U1.28 17.59,30.99 17.78,30.8 J6.P$1
IO34
  Top 0.406: U1.29 18.43,31.41 J7.P$1
IO35  (via drill 0.5)
  Top 0.406: U1.31 19.92,33.1 19.21,33.81 v18.89,33.81
  Bottom 0.406: J2.P13 23.5,19.68 22.54,20.64 22.54,22.23 21.91,22.86 21.91,24.45 21.27,25.08 21.27,29.21 20.64,29.84 20.64,32.7 19.53,33.81 v18.89,33.81
IO36  (via drill 0.5)
  Top 0.406: U1.32 19.86,33.95 19.21,34.61 v18.41,34.61
  Bottom 0.406: J2.P12 23.5,22.23 22.54,23.18 22.54,24.77 21.91,25.4 21.91,29.53 21.27,30.16 21.27,33.02 19.68,34.61 v18.41,34.61
IO37  (via drill 0.5)
  Top 0.406: U1.33 19.81,34.8 19.05,35.56 v18.57,35.56
  Bottom 0.406: J2.P11 23.5,24.77 22.54,25.72 22.54,29.84 21.91,30.48 21.91,33.34 19.68,35.56 v18.57,35.56
IO38  (via drill 0.5)
  Top 0.406: U1.34 19.91,35.65 v19.21,36.35
  Bottom 0.406: J2.P10 24.77,27.62 23.18,29.21 23.18,30.16 22.54,30.8 22.54,33.66 19.84,36.35 v19.21,36.35
IO39
  Top 0.406: J2.P9 23.5,29.84 22.54,30.8 22.54,32.38 21.91,33.02 21.91,34.61 21.27,35.24 21.27,36.2 20.96,36.5 U1.35
IO40
  Top 0.406: J2.P8 23.5,32.38 22.54,33.34 22.54,34.92 21.91,35.56 21.91,36.51 21.07,37.35 U1.36
IO41
  Top 0.406: U1.37 21.17,38.2 22.54,36.83 22.54,35.88 23.5,34.92 J2.P7
IO42  (via drill 0.5)
  Top 0.406: J2.P6 22.86,37.47 21.27,39.05 U1.38 19.68,39.05 17.94,37.31 v16.19,37.31
  Bottom 0.406: JB1.3 12.34,12.49 12.54,12.7 12.86,12.7 13.02,12.54 13.02,12.22 13.18,12.06 13.49,12.06 13.65,12.22 14.45,12.22 14.61,12.06 14.92,12.06 15.08,12.22 15.08,18.1 16.51,19.53 16.51,21.59 14.92,23.18 14.92,28.89 13.34,30.48 13.34,35.24 15.4,37.31 v16.19,37.31
IO45  (via drill 0.5)
  Top 0.406: J4.P$1 22.23,26.35 20.95,27.62 v19.68,27.62 | U1.41 18.11,41.6 17.62,41.12 v17.62,38.1
  Bottom 0.406: v19.68,27.62 19.68,28.89 19.37,29.21 19.37,31.11 18.1,32.38 18.1,33.66 17.62,34.13 v17.62,38.1
IO46  (via drill 0.5)
  Top 0.406: J3.P$1 5.4,24.77 6.67,26.04 11.43,26.04 13.65,28.26 v18.89,28.26 | v16.67,38.26 16.67,41.12 19.7,44.15 U1.44
  Bottom 0.406: v18.89,28.26 18.89,28.73 18.73,28.89 18.73,30.8 17.46,32.07 17.46,33.34 16.99,33.81 16.99,37.62 16.67,37.94 v16.67,38.26
IO47  (via drill 0.5)
  Top 0.406: v22.54,13.34 22.09,13.34 R9.2 | U1.27 v16.73,32.86
  Bottom 0.406: J2.P16 23.5,12.06 22.54,13.02 v22.54,13.34 21.91,13.34 21.59,13.65 21.59,17.14 20.95,17.78 20.95,19.37 20.64,19.68 20.64,23.81 20,24.45 20,26.04 18.1,27.94 18.1,30.48 16.73,31.84 v16.73,32.86
IO48  (via drill 0.5)
  Top 0.406: v22.54,15.88 20.95,15.88 20.32,15.24 R8.1 | U1.30 19.29,32.63 v19.05,32.86
  Bottom 0.406: 22.54,16.51 22.54,17.14 21.59,18.1 21.59,19.68 21.27,20 21.27,24.13 20.64,24.77 20.64,28.89 20,29.53 20,32.38 19.53,32.86 v19.05,32.86 | 22.54,16.51 v22.54,15.88 | v22.54,15.88 22.54,16.51 | v22.54,15.88 22.54,15.56 23.5,14.61 J2.P15
N$1
  Top 0.254: U2.5 13.84,12.2 13.97,12.06 R5.2
N$2
  Top 0.254: U2.4 13.34,12.2 R4.2
N$3
  Top 0.61: C10.2 9.53,19.61
  Top 0.813: 7.94,18.73 C9.2
  Top 1.016: U3.3 9.53,19.61 7.94,19.61 | 7.94,19.61 F1.2 | 7.94,19.61 7.94,18.73
N$4
  Top 0.61: LED1.1 R7.2
N$5
  Top 0.61: LED2.1 21.48,11.86 20.32,13.02 R8.2
N$6
  Top 0.61: R13.2 Q2.B
N$7
  Top 0.61: R14.2 Q1.B
N$8
  Top 0.254: U2.9 16.3,14.24 16.59,14.53 16.59,15.64 17.46,16.51 R12.2
N$10
  Top 0.254: U2.8 16.44,13.74 16.67,13.97 R10.2
  Top 0.305: R10.2 17.96,14.39 18.18,14.61 18.65,14.61 18.86,14.82 R11.2
RTS  (via drill 0.5)
  Top 0.254: R14.1 20.77,21.41 20.32,20.95 20.32,19.21 19.84,18.73 18.89,18.73 18.26,19.37 14.61,19.37 14.13,19.84 13.34,19.84 v12.54,20.64 | U2.24 9.98,15.74 v9.68,16.03
  Top 0.61: R14.1 Q2.E
  Bottom 0.406: v12.54,20.64 11.43,20.64 9.84,19.05 9.84,18.41 9.21,17.78 9.21,16.51 v9.68,16.03
RXD  (via drill 0.5)
  Top 0.254: U2.26 9.82,14.74 9.53,14.45 v8.41,14.45
  Top 0.406: U1.40 v19.21,40.75
  Bottom 0.406: v8.41,14.45 7.94,14.92 7.94,18.41 8.57,19.05 8.57,19.68 10.48,21.59 10.48,36.2 15.24,40.96 18.73,40.96 18.94,40.75 v19.21,40.75 20.43,40.75 21.59,41.91 22.86,41.91 23.18,41.59 23.18,40.32 23.5,40.01 J2.P5
TXD  (via drill 0.5)
  Top 0.254: U2.25 v9.05,15.24
  Top 0.406: U1.39 v19.53,39.9 21.38,39.9 21.91,39.37 22.86,39.37 23.18,39.69 23.18,40.64 24.77,42.23 J2.P4
  Bottom 0.406: v9.05,15.24 8.57,15.72 8.57,18.1 9.21,18.73 9.21,19.37 11.11,21.27 12.06,21.27 12.7,21.91 12.7,22.23 12.54,22.38 11.39,22.38 11.11,22.66 11.11,35.88 15.56,40.32 18.41,40.32 18.84,39.9 v19.53,39.9
V_USB  (via drill 0.5, 0.6, 0.8)
  Top 0.406: R11.1 v17.3,15.24
  Top 0.61: USB1.B4A9 15.79,8.8 16.19,9.21 17.14,9.21 v17.78,9.84 C6.2 | USB1.A4B9 10.88,8.8 10.48,9.21 10.16,9.21 9.53,9.84 v8.89,9.84 C3.2 | 6.67,9.84 D1.2 | v13.49,18.89 14.13,18.89 14.29,18.73 15.72,18.73 16.03,18.41 v16.03,17.78 | v5.24,3.17 5.24,3.65 6.19,4.6 v6.19,6.35
  Top 0.813: D1.2 8.89,9.87 v8.89,9.84
  Bottom 0.61: v17.78,9.84 17.78,11.27 17.14,11.91 16.35,11.91 15.88,12.38 15.88,13.65 16.35,14.13 16.99,14.13 17.3,14.45 v17.3,15.24 16.03,16.51 v16.03,17.78 | v13.49,18.89 13.49,15.88 8.89,11.27 v8.89,9.84 7.46,9.84 6.83,9.21 6.83,7.14 6.19,6.51 v6.19,6.35 | v5.24,3.17 5.24,2.7 JB2.P$1

### Text on the board
tNames: 3V3 | LAMLOEI | EN | NODE32S3 | GND | MINI | CP2102 | 1 | 4 | 2 | 5 | TX | 6 | RX | 7 | 42 | 15 | 41 | 16 | LAMLOEI | NODE32S3 | MINI | CP2102 | 40 | 17 | 39 | 18 | 26 | 33 | 34 | 38 | 8 | 37 | 46 | 45 | 19 | 20 | 36 | 35 | 3 | 0 | 9 | 48 | 47 | 11 | P | 48 | 21 | 12 | 5V | 14 | 13 | D- | D+ | E | B
bNames: 3V3 | EN | GND | 1 | 4 | 2 | 5 | 43TXD | 6 | 44RXD | 7 | 42 | 15 | 41 | 16 | 17 | 40 | 39 | 18 | 8 | 38 | 37 | 19 | 20 | 36 | 35 | 3 | CP2102 | MINI | NODE32S3 | LAMLOEI | 9 | 0 | 48 | 10 | SCL | SDA | 5V | GND | 47 | 11 | 21 | 12 | 14 | 5V | D | 13 | D+
tDocu: ESP32-S3-MINI | U1 | J5 | J6 | J7 | J1 | J3 | J4 | J2 | C13 | 100n | Q2 | C12 | U3 | C11 | 22u | LM1117MPX | 100n | R13 | R14 | 12K | 12K | C9 | C10 | Q1 | F1 | 100n | 22u | R12 | 12K | CP2102 | U2 | R11 | 24K | R8 | R9 | R7 | R10 | 47K | 2K2 | 12K | 2K2 | C8 | LED1 | TZ1 | 100n | LED2 | D1 | C3 | R3 | C4 | R4 | R5 | C5 | R6 | C6 | C7 | BLU | 100n | 5K1 | 47p | 27 | 27 | 47p | 5K1 | 100n | 100n | YEL | C1 | R1 | R2 | C2 | 1u | 12K | 12K | 100n | USB1 | SW1 | SW2
bDocu: 100n | CB2 | 22u | CB1 | JB1